# Altium schematic sheet roboShieldMega.SchDoc
size A
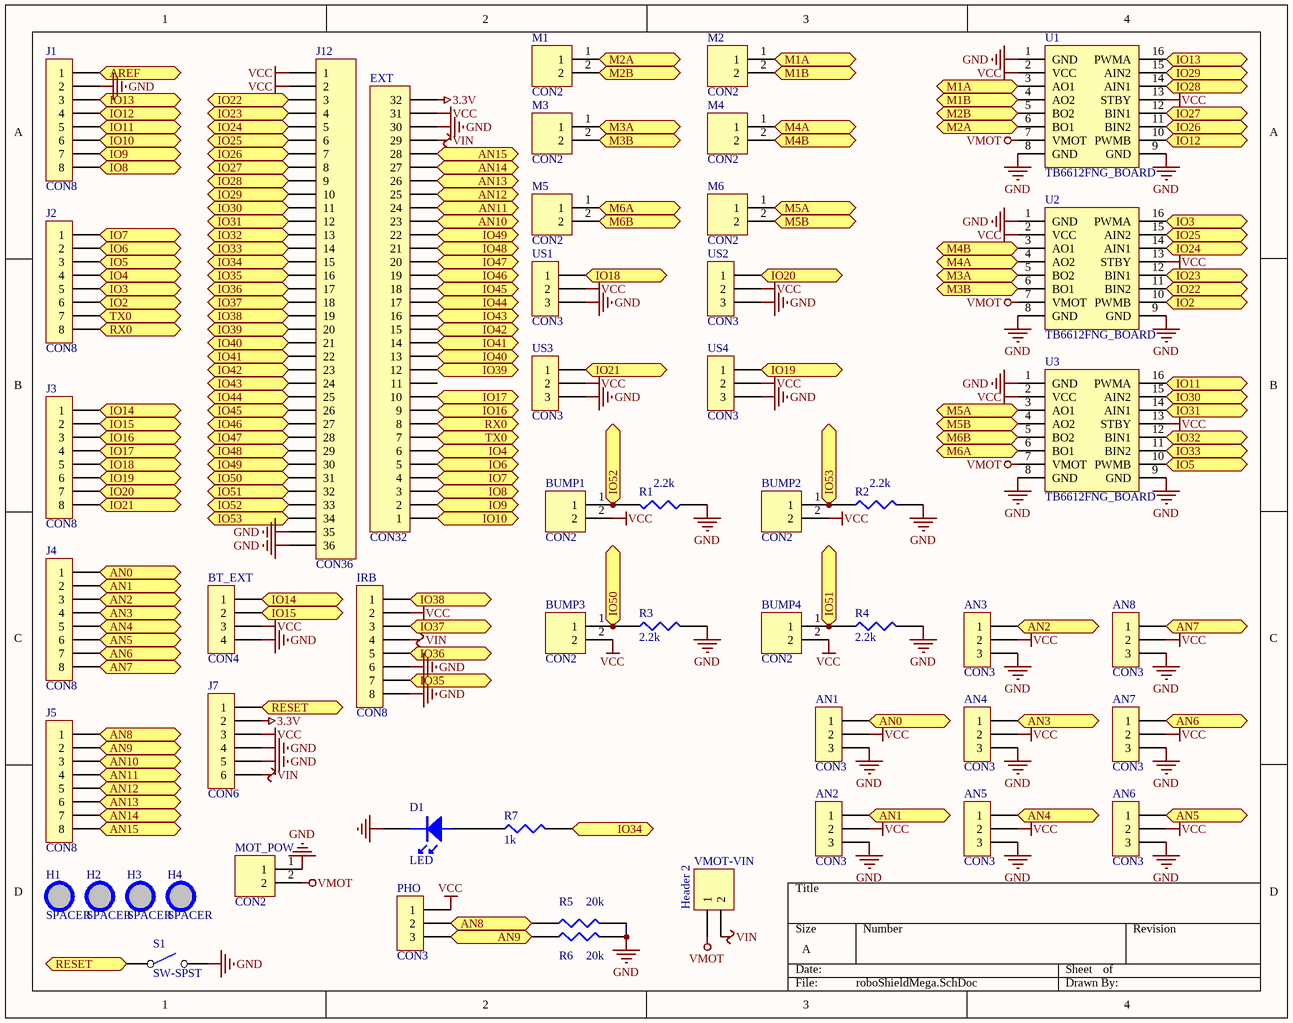
[diagram p0: roboShieldMega.SchDoc]

## Parts
AN1  CON3  [MOLEX_SH-3P-S]
AN2  CON3  [MOLEX_SH-3P-S]
AN3  CON3  [MOLEX_SH-3P-S]
AN4  CON3  [MOLEX_SH-3P-S]
AN5  CON3  [MOLEX_SH-3P-S]
AN6  CON3  [MOLEX_SH-3P-S]
AN7  CON3  [MOLEX_SH-3P-S]
AN8  CON3  [MOLEX_SH-3P-S]
BT_EXT  CON4  [MOLEX_SH-4P-S]
BUMP1  CON2  [MOLEX_SH-2P-S]
BUMP2  CON2  [MOLEX_SH-2P-S]
BUMP3  CON2  [MOLEX_SH-2P-S]
BUMP4  CON2  [MOLEX_SH-2P-S]
D1  LED  [2PIN_2MM]
EXT  CON32  [32PIN_2.54MM_DOUBLE]
H1  SPACER  [SPACER_MINI_2MM]
H2  SPACER  [SPACER_MINI_2MM]
H3  SPACER  [SPACER_MINI_2MM]
H4  SPACER  [SPACER_MINI_2MM]
IRB  CON8  [WM18114]
J1  CON8  [8PIN_2.54MM]
J2  CON8  [8PIN_2.54MM]
J3  CON8  [8PIN_2.54MM]
J4  CON8  [8PIN_2.54MM]
J5  CON8  [8PIN_2.54MM]
J7  CON6  [6PIN_2.54MM_STRAIGHT]
J12  CON36  [36PIN_2.54MM_DOUBLE]
M1  CON2  [MOLEX_SH-2P-S]
M2  CON2  [MOLEX_SH-2P-S]
M3  CON2  [MOLEX_SH-2P-S]
M4  CON2  [MOLEX_SH-2P-S]
M5  CON2  [MOLEX_SH-2P-S]
M6  CON2  [MOLEX_SH-2P-S]
MOT_POW  CON2  [MOLEX_SH-2P-S]
PHO  CON3  [MOLEX_SH-3P-S]
R1  2.2k  [0805]
R2  2.2k  [0805]
R3  2.2k  [0805]
R4  2.2k  [0805]
R5  20k  [0805]
R6  20k  [0805]
R7  1k  [0805]
S1  SW-SPST  [PUSH_BUTTON_JPM]
U1  TB6612FNG_BOARD  [TB6612FNG_BOARD]
U2  TB6612FNG_BOARD  [TB6612FNG_BOARD]
U3  TB6612FNG_BOARD  [TB6612FNG_BOARD]
US1  CON3  [MOLEX_SH-3P-S]
US2  CON3  [MOLEX_SH-3P-S]
US3  CON3  [MOLEX_SH-3P-S]
US4  CON3  [MOLEX_SH-3P-S]
VMOT-VIN  Header 2  [HDR1X2]

## Ports
AN0, AN1, AN2, AN3, AN4, AN5, AN6, AN7, AN8, AN9, AN10, AN11, AN12, AN13, AN14, AN15, AREF, IO2, IO3, IO4, IO5, IO6, IO7, IO8, IO9, IO10, IO11, IO12, IO13, IO14, IO15, IO16, IO17, IO18, IO19, IO20, IO21, IO22, IO23, IO24, IO25, IO26, IO27, IO28, IO29, IO30, IO31, IO32, IO33, IO34, IO35, IO36, IO37, IO38, IO39, IO40, IO41, IO42, IO43, IO44, IO45, IO46, IO47, IO48, IO49, IO50, IO51, IO52, IO53, M1A, M1B, M2A, M2B, M3A, M3B, M4A, M4B, M5A, M5B, M6A, M6B, RESET, RX0, TX0

## Nets
3.3V: EXT.32 J7.2
GND: AN1.3 AN2.3 AN3.3 AN4.3 AN5.3 AN6.3 AN7.3 AN8.3 BT_EXT.4 D1.2(CATHODE) EXT.30 IRB.6 IRB.8 J1.2 J7.4 J7.5 J12.35 J12.36 MOT_POW.1 R1.1 R2.2 R3.2 R4.2 R5.2 R6.2 S1.2 U1.1(GND) U1.8(GND) U1.9(GND) U2.1(GND) U2.8(GND) U2.9(GND) U3.1(GND) U3.8(GND) U3.9(GND) US1.3 US2.3 US3.3 US4.3
VCC: AN1.2 AN2.2 AN3.2 AN4.2 AN5.2 AN6.2 AN7.2 AN8.2 BT_EXT.3 BUMP1.2 BUMP2.2 BUMP3.2 BUMP4.2 EXT.31 IRB.2 J7.3 J12.1 J12.2 PHO.1 U1.2(VCC) U1.13(STBY) U2.2(VCC) U2.13(STBY) U3.2(VCC) U3.13(STBY) US1.2 US2.2 US3.2 US4.2
VIN: EXT.29 IRB.4 J7.6 VMOT-VIN.2
VMOT: MOT_POW.2 U1.7(VMOT) U2.7(VMOT) U3.7(VMOT) VMOT-VIN.1
AN0: AN1.1 J4.1 ; port AN0
AN1: AN2.1 J4.2 ; port AN1
AN2: AN3.1 J4.3 ; port AN2
AN3: AN4.1 J4.4 ; port AN3
AN4: AN5.1 J4.5 ; port AN4
AN5: AN6.1 J4.6 ; port AN5
AN6: AN7.1 J4.7 ; port AN6
AN7: AN8.1 J4.8 ; port AN7
AN8: J5.1 PHO.2 R5.1 ; port AN8
AN9: J5.2 PHO.3 R6.1 ; port AN9
AN10: EXT.23 J5.3 ; port AN10
AN11: EXT.24 J5.4 ; port AN11
AN12: EXT.25 J5.5 ; port AN12
AN13: EXT.26 J5.6 ; port AN13
AN14: EXT.27 J5.7 ; port AN14
AN15: EXT.28 J5.8 ; port AN15
AREF: J1.1 ; port AREF
IO2: J2.6 U2.10(PWMB) ; port IO2
IO3: J2.5 U2.16(PWMA) ; port IO3
IO4: EXT.6 J2.4 ; port IO4
IO5: J2.3 U3.10(PWMB) ; port IO5
IO6: EXT.5 J2.2 ; port IO6
IO7: EXT.4 J2.1 ; port IO7
IO8: EXT.3 J1.8 ; port IO8
IO9: EXT.2 J1.7 ; port IO9
IO10: EXT.1 J1.6 ; port IO10
IO11: J1.5 U3.16(PWMA) ; port IO11
IO12: J1.4 U1.10(PWMB) ; port IO12
IO13: J1.3 U1.16(PWMA) ; port IO13
IO14: BT_EXT.1 J3.1 ; port IO14
IO15: BT_EXT.2 J3.2 ; port IO15
IO16: EXT.9 J3.3 ; port IO16
IO17: EXT.10 J3.4 ; port IO17
IO18: J3.5 US1.1 ; port IO18
IO19: J3.6 US4.1 ; port IO19
IO20: J3.7 US2.1 ; port IO20
IO21: J3.8 US3.1 ; port IO21
IO22: J12.3 U2.11(BIN2) ; port IO22
IO23: J12.4 U2.12(BIN1) ; port IO23
IO24: J12.5 U2.14(AIN1) ; port IO24
IO25: J12.6 U2.15(AIN2) ; port IO25
IO26: J12.7 U1.11(BIN2) ; port IO26
IO27: J12.8 U1.12(BIN1) ; port IO27
IO28: J12.9 U1.14(AIN1) ; port IO28
IO29: J12.10 U1.15(AIN2) ; port IO29
IO30: J12.11 U3.15(AIN2) ; port IO30
IO31: J12.12 U3.14(AIN1) ; port IO31
IO32: J12.13 U3.12(BIN1) ; port IO32
IO33: J12.14 U3.11(BIN2) ; port IO33
IO34: J12.15 R7.2 ; port IO34
IO35: IRB.7 J12.16 ; port IO35
IO36: IRB.5 J12.17 ; port IO36
IO37: IRB.3 J12.18 ; port IO37
IO38: IRB.1 J12.19 ; port IO38
IO39: EXT.12 J12.20 ; port IO39
IO40: EXT.13 J12.21 ; port IO40
IO41: EXT.14 J12.22 ; port IO41
IO42: EXT.15 J12.23 ; port IO42
IO43: EXT.16 J12.24 ; port IO43
IO44: EXT.17 J12.25 ; port IO44
IO45: EXT.18 J12.26 ; port IO45
IO46: EXT.19 J12.27 ; port IO46
IO47: EXT.20 J12.28 ; port IO47
IO48: EXT.21 J12.29 ; port IO48
IO49: EXT.22 J12.30 ; port IO49
IO50: BUMP3.1 J12.31 R3.1 ; port IO50
IO51: BUMP4.1 J12.32 R4.1 ; port IO51
IO52: BUMP1.1 J12.33 R1.2 ; port IO52
IO53: BUMP2.1 J12.34 R2.1 ; port IO53
M1A: M2.1 U1.3(AO1) ; port M1A
M1B: M2.2 U1.4(AO2) ; port M1B
M2A: M1.1 U1.6(BO1) ; port M2A
M2B: M1.2 U1.5(BO2) ; port M2B
M3A: M3.1 U2.5(BO2) ; port M3A
M3B: M3.2 U2.6(BO1) ; port M3B
M4A: M4.1 U2.4(AO2) ; port M4A
M4B: M4.2 U2.3(AO1) ; port M4B
M5A: M6.1 U3.3(AO1) ; port M5A
M5B: M6.2 U3.4(AO2) ; port M5B
M6A: M5.1 U3.6(BO1) ; port M6A
M6B: M5.2 U3.5(BO2) ; port M6B
RESET: J7.1 S1.1 ; port RESET
RX0: EXT.8 J2.8 ; port RX0
TX0: EXT.7 J2.7 ; port TX0
NetD1_1: D1.1(ANODE) R7.1

Not connected (* = marked no-connect by the designer): EXT 11

## Library data of the parts
AN1-AN8 PHO US1-US4 = CON3: 3 pin header
BT_EXT = CON4: 4 pin header
BUMP1-BUMP4 M1-M6 MOT_POW = CON2: 2 pin header
D1 = LED: General LED
EXT = CON32: Connector
H1-H4 = SPACER: 0.25 x 4-40 spacer hole; Text Field3: custom height
IRB J1-J5 = CON8: 8 pin header
J7 = CON6: 6 pin header
J12 = CON36: Connector
R1-R7 = RES: Generic Resistor
U1-U3 = TB6612FNG_BOARD: H-Bridge dual  board from Pololu, with TB6612FNG chip; Text Field1: MAX4674; Text Field2: Maxim IC
VMOT-VIN = Header 2: Header, 2-Pin; LatestRevisionDate: 17-Jul-2002; LatestRevisionNote: Re-released for DXP Platform.; Publisher: Altium Limited